# EAGLE schematic test_device_edit (EAGLE 9.6.2)
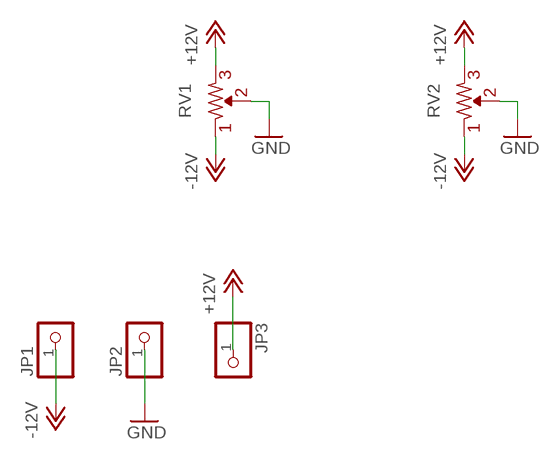
[diagram p0: schematic, sheet 1]

## Parts
JP1  PINHD-1X1  [1X01]
JP2  PINHD-1X1  [1X01]
JP3  PINHD-1X1  [1X01]
RV1  R-VAR  [R-VAR]
RV2  R-VARR-VAR-10  [_COMMON_3RP/1610N]

## Nets
+12V: JP3.1 RV1.R2 RV2.3
-12V: JP1.1 RV1.R1 RV2.1
GND: JP2.1 RV1.VAR RV2.2

## Library data of the parts
JP1-JP3 = pinhead:PINHD-1X1: PIN HEADER
RV1 RV2 = _common:R-VAR